# EasyEDA Pro project balance_vehicle_P1.epro

# Schematic balance_vehicle
Board Name: Board1; Create Date: 2024-12-16; Page Name: balance_vehicle_P1; Project Name: balance_vehicle; Schematic Name: balance_vehicle; Update Date: 2024-12-17; Company: 嘉立创EDA; Page Size: A4; Version: V1.0
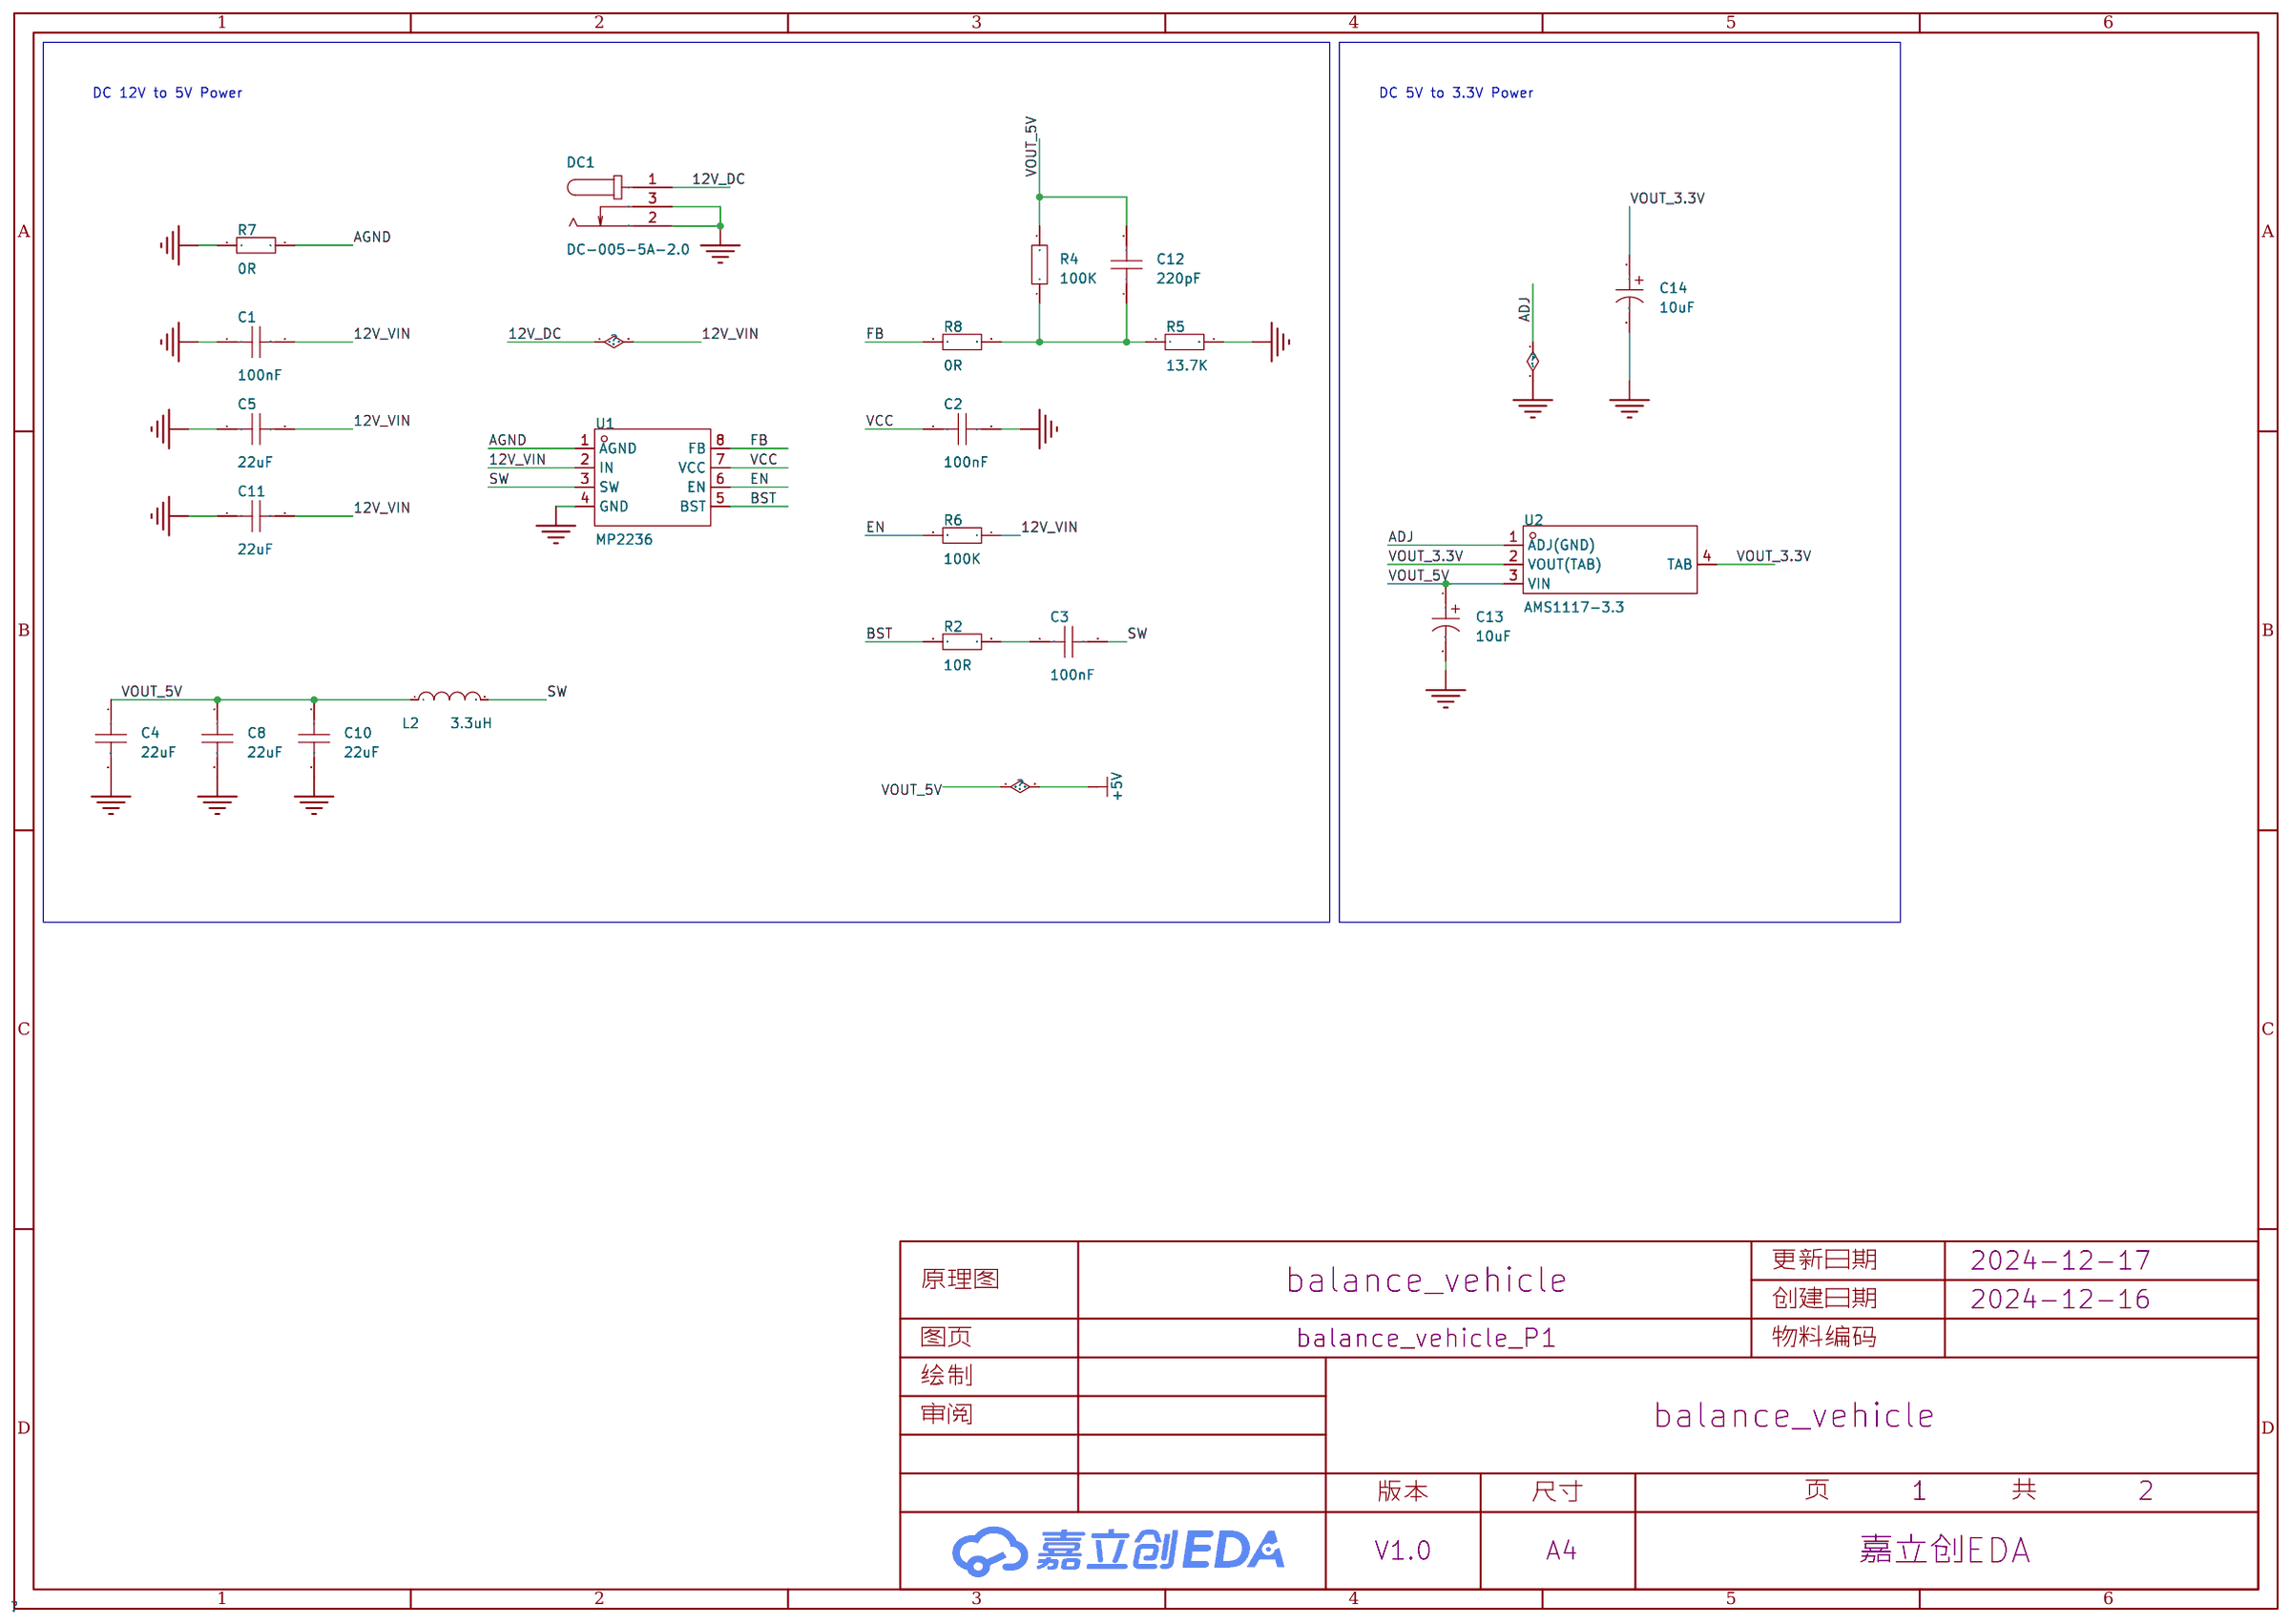
[diagram p0: schematic sheet]

## Parts
C1  100nF  [C0805]
C2  100nF  [C0805]
C3  100nF  [C0805]
C4  22uF  [C0805]
C5  22uF  [C0805]
C8  22uF  [C0805]
C10  22uF  [C0805]
C11  22uF  [C0805]
C12  220pF  [C0805]
C13  10uF  [CAP-SMD_L2.0-W1.3-FD]
C14  10uF  [CAP-SMD_L2.0-W1.3-FD]
DC1  DC-005-5A-2.0  [DC-IN-TH_DC-005-5A-2.0]
L2  3.3uH  [IND-SMD_L7.1-W6.6_MJC-0603T]
R2  10R  [R0805]
R4  100K  [R0805]
R5  13.7K  [R0805]
R6  100K  [R0805]
R7  0R  [R0805]
R8  0R  [R0805]
U1  MP2236  [SOT-23-8_L3.0-W1.7-P0.65-LS2.8-BL]
U2  AMS1117-3.3  [SOT-223-4_L6.5-W3.5-P2.30-LS7.0-BR]

## Library data of the parts
C1-C5 C8 C10-C12 = CAP_0805: Supplier Footprint: 0805
C13 C14 = TMCP1A106MTRF: 容值:10uF;精度:±20%;额定电压:10V;等效串联电阻:5.9Ω@100kHz;; LCSC Part Name: 10uF ±20% 10V; Supplier Part: C1969735; Manufacturer: VISHAY(威世); Supplier Footprint: 0805; JLCPCB Part Class: 扩展库; Datasheet: https://atta.szlcsc.com/upload/public/pdf/source/20210506/EB7F77920409F8D63FFE94178A7159DC.pdf; Supplier: LCSC; Tolerance: ±20%; Rated Voltage: 10V; Equivalent Series Resistance(ESR): 5.9Ω@100kHz; Operating Temperature: -55℃~+125℃
DC1 = DC-005-5A-2.0: 连接器类型:DC电源插座;安装方式:弯插;触点内径:2mm;触点外径:6.2mm;额定电流:5A;额定电压:24V;工作温度范围:-20℃~+70℃;; LCSC Part Name: DC电源插座 内径:2mm 外径:6.2mm; Supplier Part: C381116; Manufacturer: XKB Connection(中国星坤); Supplier Footprint: 插件; JLCPCB Part Class: 扩展库; Datasheet: https://atta.szlcsc.com/upload/public/pdf/source/20211015/707A35F7AB6E89C57AAB641950105BB7.pdf; Supplier: LCSC; Connector Type: DC电源插座; Mounting Style: 弯插; Inside Contact Diameter: 2mm; Outside Contact Diameter: 6.2mm; Current Rating (Max): 5A; Voltage Rating (Max): 24V; Operating Temperature Range: -20℃~+70℃
L2 = CXP0630-5R6M-AG(5.6uh): 电感值:5.6uH;精度:±20%;额定电流:5.5A;饱和电流(Isat):7A;类型:一体成型电感;; LCSC Part Name: 5.6uH ±20% 7A; Supplier Part: C7461360; Manufacturer: DMBJ(振宝佳); Supplier Footprint: 0630; Datasheet: https://atta.szlcsc.com/upload/public/pdf/source/20230706/7F3A5B39C5AD80A91C9FA782B54A296B.pdf; Supplier: LCSC; Tolerance: ±20%; Rated Current: 5.5A; Saturation Current (Isat): 7A; DC Resistance (DCR): 42mΩ; Type: 一体成型电感
R2 R4-R8 = Res_0805: Supplier Footprint: 0805
U1 = MP2236: Supplier Part: C9900030582; Supplier Footprint: SOT23-8; JLCPCB Part Class: 扩展库; Supplier: LCSC
U2 = AMS1117-3.3_C347222: 输出类型:固定;最大输入电压:18V;输出电压:3.3V;输出电流:1A;电源纹波抑制比(PSRR):60dB@(120Hz);输出极性:正极;; LCSC Part Name: 输出:3.3V 电流:1A 耐压:12V; Supplier Part: C347222; Manufacturer: UMW(友台半导体); Supplier Footprint: SOT-223; JLCPCB Part Class: 扩展库; Datasheet: https://atta.szlcsc.com/upload/public/pdf/source/20231109/155D79A26D9DB04352555A58D5969DC8.pdf; Supplier: LCSC; Output Type: 固定; Maximum Input Voltage: 18V; Output Voltage: 3.3V; Output Current: 1A; Power Supply Rejection Ratio (PSRR): 60dB@(120Hz); Dropout Voltage: 1.3V@(1A); Feature: 过流保护(OCP); Output Polarity: 正极; Number of Outputs: 1

## Nets
12V_DC: C1.2 C5.2 C11.2 DC1.1 R6.1 U1.2(IN)
+5V: C4.1 C8.1 C10.1 C12.2 C13.1 L2.1 R4.2 U2.3(VIN)
AGND: R7.2 U1.1(AGND)
GND: C1.1 C2.2 C4.2 C5.1 C8.2 C10.2 C11.1 C13.2 C14.2 DC1.2 DC1.3 R5.2 R7.1 U1.4(GND) U2.1(ADJ(GND))
VCC: C2.1 U1.7(VCC)
BST: R2.1 U1.5(BST)
EN: R6.2 U1.6(EN)
FB: R8.1 U1.8(FB)
SW: C3.2 L2.2 U1.3(SW)
VOUT_3.3V: C14.1 U2.2(VOUT(TAB)) U2.4(TAB)
Net-(C3-1): C3.1 R2.2
Net-(C12-1): C12.1 R4.1 R5.1 R8.2

## Notes on the sheet
- DC 12V to 5V Power
- DC 5V to 3.3V Power
